# EasyEDA Pro project RemoteController.eprj

# Schematic Schematic1
Create Date: 2024-01-11; Page Name: P1; Project Name: 机甲杯手柄pcb; Schematic Name: Schematic1; Update Date: 2024-02-25; Company: 嘉立创EDA; Page Size: A4; Version: V1.0
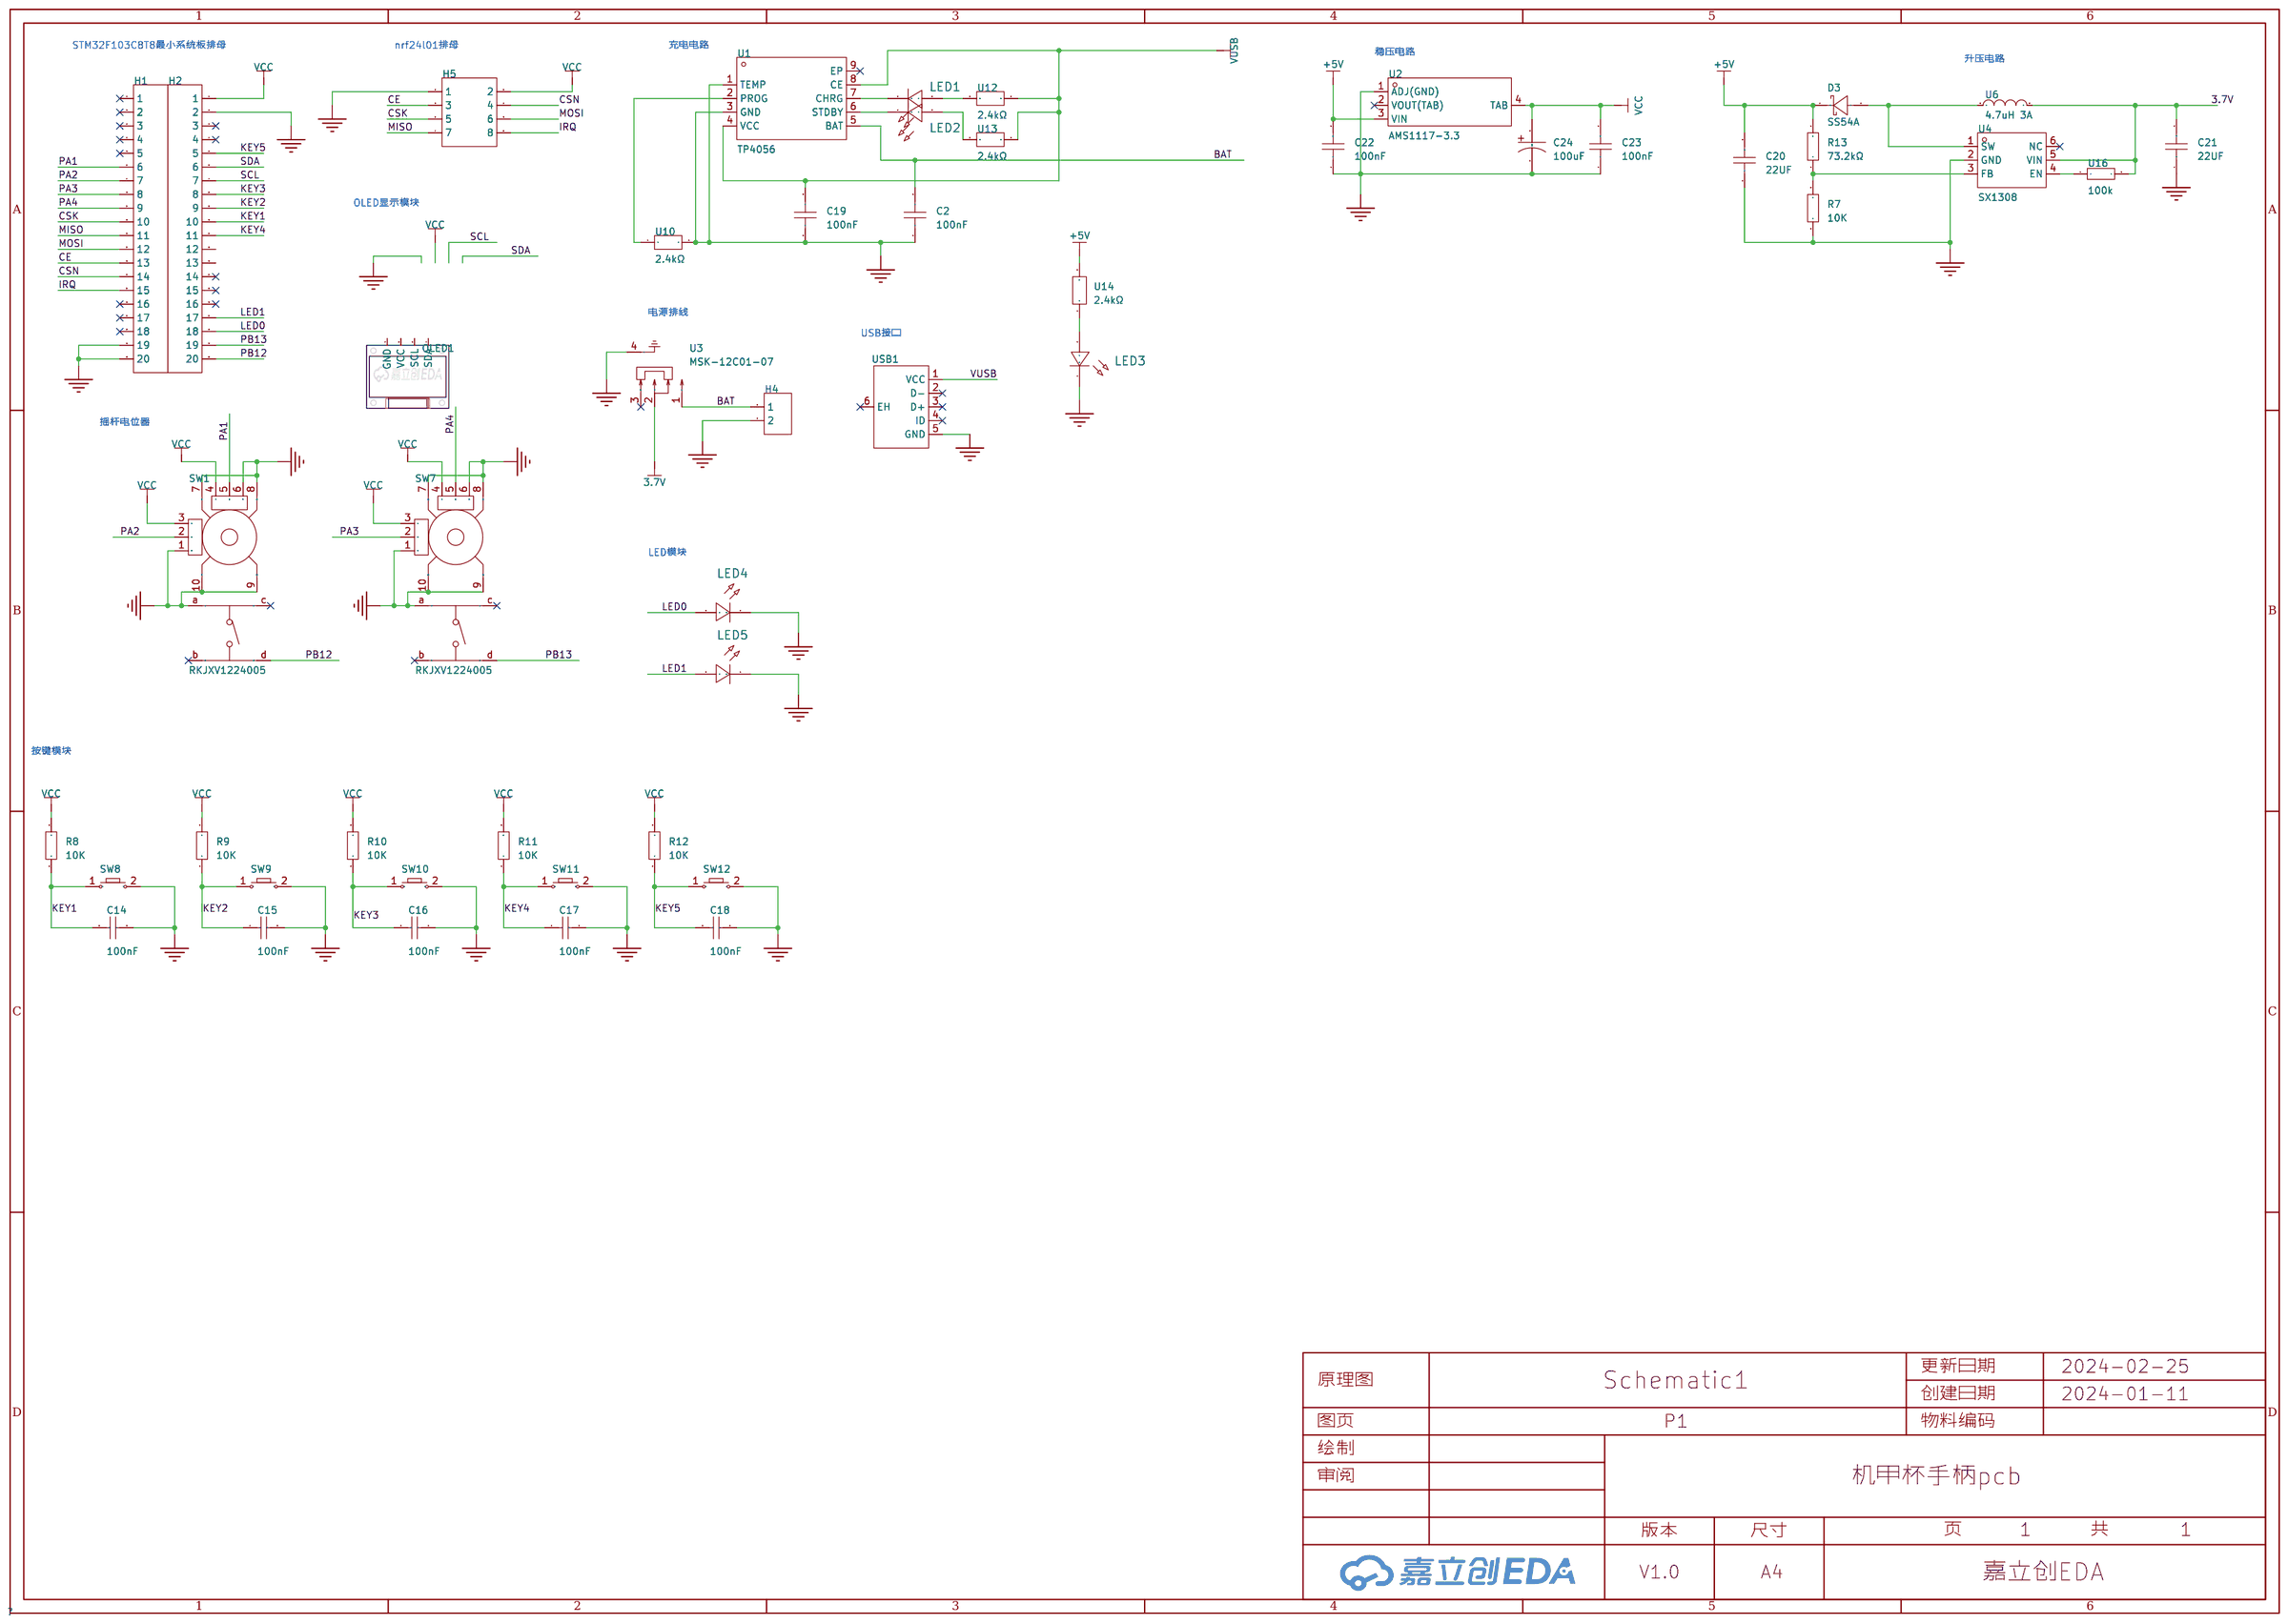
[diagram p0: schematic sheet]

## Parts
C2  100nF  [C0805]
C14  100nF  [C0805]
C15  100nF  [C0805]
C16  100nF  [C0805]
C17  100nF  [C0805]
C18  100nF  [C0805]
C19  100nF  [C0805]
C20  22UF  [C1206]
C21  22UF  [C1206]
C22  100nF  [C0603]
C23  100nF  [C0603]
C24  100uF  [CASE-D_7343]
D3  SS54A  [SMA_L4.2-W2.6-LS5.1-RD]
H1  -  [HDR-TH_20P-P2.54-V-F]
H2  -  [HDR-TH_20P-P2.54-V-F]
H4  -  [HDR-TH_2P-P2.54-V-F]
H5  -  [HDR-TH_8P-P2.54-V-F-R2-C4-S2.54-1]
LED1  -  [LED_0603]
LED2  -  [LED_0603]
LED3  -  [LED_0603]
LED4  -  [LED_0603]
LED5  -  [LED_0603]
OLED1  -  [0.96OLED_4P]
R7  10K  [R0603]
R8  10K  [R0603]
R9  10K  [R0603]
R10  10K  [R0603]
R11  10K  [R0603]
R12  10K  [R0603]
R13  73.2kΩ  [R0603]
SW1  RKJXV1224005  [SW-TH_RKJXV1224005]
SW7  RKJXV1224005  [SW-TH_RKJXV1224005]
SW8  -  [Key_SMD_3x4x2]
SW9  -  [Key_SMD_3x4x2]
SW10  -  [Key_SMD_3x4x2]
SW11  -  [Key_SMD_3x4x2]
SW12  -  [Key_SMD_3x4x2]
U1  TP4056  [ESOP-8_L4.9-W3.9-P1.27-LS6.0-BL-EP]
U2  AMS1117-3.3  [SOT-223-4_L6.5-W3.5-P2.30-LS7.0-BR]
U3  MSK-12C01-07  [SW-SMD_MSK12CO2-BDM]
U4  SX1308  [SOT-23-6_L2.9-W1.6-P0.95-LS2.8-BL]
U6  4.7uH 3A  [IND-SMD_L7.3-W7.3_GSDRH74P]
U10  2.4kΩ  [R0603]
U12  2.4kΩ  [R0603]
U13  2.4kΩ  [R0603]
U14  2.4kΩ  [R0603]
U16  100k  [R0603]
USB1  -  [USB_Micro]

## Library data of the parts
C2 C14-C19 = CL21B104KCFNNNE: 容值:100nF;精度:±10%;额定电压:100V;材质(温度系数):X7R;; LCSC Part Name: 100nF ±10% 100V; Supplier Part: C28233; Manufacturer: SAMSUNG(三星); Supplier Footprint: 0805; JLCPCB Part Class: 基础库; Datasheet: https://atta.szlcsc.com/upload/public/pdf/source/20160218/1457707763339.pdf; Supplier: LCSC; Tolerance: ±10%; Voltage Rated: 100V; Temperature Coefficient: X7R
C20 C21 = 22UF: Supplier Part: C9900008064; Supplier Footprint: 1206; JLCPCB Part Class: 扩展库; Supplier: LCSC
C22 C23 = CC0603KRX7R9BB104: 容值:100nF;精度:±10%;额定电压:50V;材质(温度系数):X7R;; LCSC Part Name: 100nF ±10% 50V; Supplier Part: C14663; Manufacturer: YAGEO(国巨); Supplier Footprint: 0603; JLCPCB Part Class: 基础库; Datasheet: https://atta.szlcsc.com/upload/public/pdf/source/20180910/C282072_33301C7F631E79921B82A8DAC6BCC5B3.pdf; Supplier: LCSC; Tolerance: ±10%; Voltage Rated: 50V; Temperature Coefficient: X7R
C24 = NOJD107M006RWJ: 容值:100uF;精度:±20%;额定电压:6.3V;等效串联电阻:400mΩ@100kHz;; LCSC Part Name: 100uF ±20% 6.3V; Supplier Part: C308911; Manufacturer: Kyocera AVX; Supplier Footprint: CASE-D-7343; JLCPCB Part Class: 扩展库; Datasheet: https://atta.szlcsc.com/upload/public/pdf/source/20181129/C313062_608915A7FC61F417DBFBE9E11EC9EEDE.pdf; Supplier: LCSC; Tolerance: ±20%; Rated Voltage: 6.3V; Equivalent Series Resistance(ESR): 400mΩ@100kHz; Operating Temperature: -55℃~+105℃
D3 = SS54A: 二极管配置:独立式;正向压降(Vf):550mV@5A;直流反向耐压(Vr):40V;平均整流电流(Io):5A;; LCSC Part Name: 电压:40V 电流:5A; Supplier Part: C842792; Manufacturer: FUXINSEMI(富芯森美); Supplier Footprint: SMA(DO-214AC); JLCPCB Part Class: 扩展库; Datasheet: https://atta.szlcsc.com/upload/public/pdf/source/20200930/C842792_5106C80DF0E850BA03D1CC0EA757AD9D.pdf; Supplier: LCSC; Diode Configuration: 独立式; Forward Voltage (Vf@If): 550mV@5A; Reverse Voltage (Vr): 40V; Average Rectified Current (Io): 5A; Reverse Leakage Current (Ir): 500nA
H1 H2 = HDR-F_2.54_1x20P: Supplier Part: C50984; Supplier Footprint: 插件
H4 = HDR-F_2.54_1x2P: Supplier Part: C49661; Supplier Footprint: 插件
H5 = HDR-F_2.54_2x4: Supplier Part: C92271; Supplier Footprint: 插件; JLCPCB Part Class: 扩展库
LED1-LED5 = LED_0603-R: Supplier Footprint: 0603
OLED1 = 0.96OLED模块_4P: Supplier Footprint: 插件
R7-R12 = Res_0603: Supplier Footprint: 0603
R13 = AC0603FR-0773K2L: 电阻类型:厚膜电阻;阻值:73.2kΩ;精度:±1%;功率:100mW;最大工作电压:75V;温度系数:±100ppm/℃;; LCSC Part Name: 厚膜电阻 73.2kΩ ±1% 100mW; Supplier Part: C228044; Manufacturer: YAGEO(国巨); Supplier Footprint: 0603; JLCPCB Part Class: 扩展库; Datasheet: https://atta.szlcsc.com/upload/public/pdf/source/20181031/C228044_B46D30D08D205BDF2C7D9FF4D943A2A8.pdf; Supplier: LCSC; Type: 厚膜电阻; Tolerance: ±1%; Power(Watts): 100mW; Overload Voltage (Max): 75V; Temperature Coefficient: ±100ppm/℃; Operating Temperature Range: -55℃~+155℃
SW1 SW7 = RKJXV1224005: 操纵杆复位 中央按动开关 适用于航模玩具遥控器电位器、3D摇杆PS4手柄游戏机、无人机摇杆电位器、工业控制器; Supplier Part: C146170; Manufacturer: ALPSALPINE(阿尔卑斯阿尔派); Supplier Footprint: 插件,13x13mm; JLCPCB Part Class: 扩展库; Datasheet: https://atta.szlcsc.com/upload/public/pdf/source/20180125/C146170_15168615510911301620.pdf; Supplier: LCSC
SW8-SW12 = Key_SMD_3x4x2: Supplier Footprint: SMD
U1 = TP4056: Supplier Part: C9900002169; Supplier Footprint: ESOP-8; JLCPCB Part Class: 扩展库; Supplier: LCSC
U2 = AMS1117-3.3_C347222: 输出类型:固定;最大输入电压:18V;输出电压:3.3V;输出电流:1A;电源纹波抑制比(PSRR):60dB@(120Hz);输出极性:正;; LCSC Part Name: 输入18V 输出3.3V 1A; Supplier Part: C347222; Manufacturer: UMW(友台半导体); Supplier Footprint: SOT-223; JLCPCB Part Class: 扩展库; Datasheet: https://atta.szlcsc.com/upload/public/pdf/source/20231109/155D79A26D9DB04352555A58D5969DC8.pdf; Supplier: LCSC; Output Type: 固定; Maximum Input Voltage: 18V; Output Voltage: 3.3V; Output Current: 1A; Power Supply Rejection Ratio (PSRR): 60dB@(120Hz); Dropout Voltage: 1.3V@(1A); Output Polarity: 正; Number of Outputs: 1
U3 = MSK-12C01-07: Supplier Part: C9900005167; Supplier Footprint: SMD; JLCPCB Part Class: 扩展库; Supplier: LCSC
U4 = SX1308: 功能类型:升压型;同步整流:否;输出通道数:1;拓扑结构:升压式;输入电压:2V~24V;输出电压:28V;输出电流(最大值):-;开关频率:1.2MHz;; LCSC Part Name: 升压型 Vin=2V~24V Vout=28V; Supplier Part: C78162; Manufacturer: SX(硕芯科技); Supplier Footprint: SOT-23-6; JLCPCB Part Class: 扩展库; Datasheet: https://atta.szlcsc.com/upload/public/pdf/source/20160920/1474356679185.pdf; Supplier: LCSC; Function: 升压型; Synchronous Rectification: 否; Number of Outputs: 1; Topology: 升压式; Input Voltage: 2V~24V; Output Voltage: 28V; Switching Frequency: 1.2MHz
U6 = 4.7uH 3A: Supplier Part: C9900003590; Supplier Footprint: 4.7uH2A; JLCPCB Part Class: 扩展库; Datasheet: https://atta.szlcsc.comnull; Supplier: LCSC
U10 U12-U14 = PTFR0603B2K40N9: 电阻类型:薄膜电阻;阻值:2.4kΩ;精度:±0.1%;功率:100mW;最大工作电压:100V;温度系数:±10ppm/℃;; LCSC Part Name: 薄膜电阻 2.4kΩ ±0.1% 100mW; Supplier Part: C2692752; Manufacturer: RESI(开步睿思）; Supplier Footprint: 0603; JLCPCB Part Class: 扩展库; Datasheet: https://atta.szlcsc.com/upload/public/pdf/source/20231020/37F75D505DFC5CA75CC16B0F0ECD8764.pdf; Supplier: LCSC; Type: 薄膜电阻; Tolerance: ±0.1%; Power(Watts): 100mW; Overload Voltage (Max): 100V; Temperature Coefficient: ±10ppm/℃; Operating Temperature Range: -55℃~+125℃
U16 = 100k: Supplier Part: C9900012835; JLCPCB Part Class: 扩展库; Supplier: LCSC
USB1 = USB_Micro-B: Supplier Footprint: SMD

## Nets
3.7V: C21.2 U3.2 U4.5(VIN) U6.2 U16.2
+5V: C20.2 C22.2 D3.1(C) R13.2 U2.3(VIN) U14.2
GND: C2.1 C14.2 C15.2 C16.2 C17.2 C18.2 C19.1 C20.1 C21.1 C22.1 C23.1 C24.2 H1.19 H1.20 H2.2 H4.2 H5.1 LED3.1(C) LED4.1(C) LED5.1(C) R7.1 SW1.1(B) SW1.6(B) SW1.7(GND) SW1.8(GND) SW1.9(GND) SW1.10(GND) SW1.a SW7.1(B) SW7.6(B) SW7.7(GND) SW7.8(GND) SW7.9(GND) SW7.10(GND) SW7.a SW8.2 SW9.2 SW10.2 SW11.2 SW12.2 U1.1(TEMP) U1.3(GND) U2.1(ADJ(GND)) U3.4 U4.2(GND) U10.2 USB1.5(GND)
VCC: C23.2 C24.1 H2.1 H5.2 R8.2 R9.2 R10.2 R11.2 R12.2 SW1.3(A) SW1.4(A) SW7.3(A) SW7.4(A) U2.4(TAB)
BAT: C2.2 H4.1 U1.5(BAT) U3.1
CE: H1.13 H5.3
CSK: H1.10 H5.5
CSN: H1.14 H5.4
IRQ: H1.15 H5.8
KEY1: C14.1 H2.10 R8.1 SW8.1
KEY2: C15.1 H2.9 R9.1 SW9.1
KEY3: C16.1 H2.8 R10.1 SW10.1
KEY4: C17.1 H2.11 R11.1 SW11.1
KEY5: C18.1 H2.5 R12.1 SW12.1
LED0: H2.18 LED4.2(A)
LED1: H2.17 LED5.2(A)
MISO: H1.11 H5.7
MOSI: H1.12 H5.6
PA1: H1.6 SW1.5(DTA)
PA2: H1.7 SW1.2(DTA)
PA3: H1.8 SW7.2(DTA)
PA4: H1.9 SW7.5(DTA)
PB12: H2.20 SW1.d
PB13: H2.19 SW7.d
SCL: H2.7
SDA: H2.6
VUSB: C19.2 U1.4(VCC) U1.8(CE) U12.2 U13.2 USB1.1(VCC)
$1N9186: U1.2(PROG) U10.1
$1N9797: LED1.1(C) U1.7(CHRG)
$1N9800: LED2.1(C) U1.6(STDBY)
$1N9803: LED1.2(A) U12.1
$1N9806: LED2.2(A) U13.1
$1N10862: LED3.2(A) U14.1
$1N14342: U4.4(EN) U16.1
$1N14522: R7.2 R13.1 U4.3(FB)
$1N32004: D3.2(A) U4.1(SW) U6.1

Not connected (* = marked no-connect by the designer): H1 1* 2* 3* 4* 5* 16* 17* 18*; H2 3* 4* 12 13 14* 15* 16*; OLED1 1(GND) 2(VCC) 3(SCL) 4(SDA); SW1 b* c*; SW7 b* c*; U1 9(EP)*; U2 2(VOUT(TAB))*; U3 3*; U4 6(NC)*; USB1 2(D-)* 3(D+)* 4(ID)* 6(EH)*

## Notes on the sheet
- STM32F103C8T8最小系统板排母
- nrf24l01排母
- 充电电路
- 稳压电路
- 升压电路
- OLED显示模块
- 电源排线
- USB接口
- 摇杆电位器
- LED模块
- 按键模块

# Board PCB1
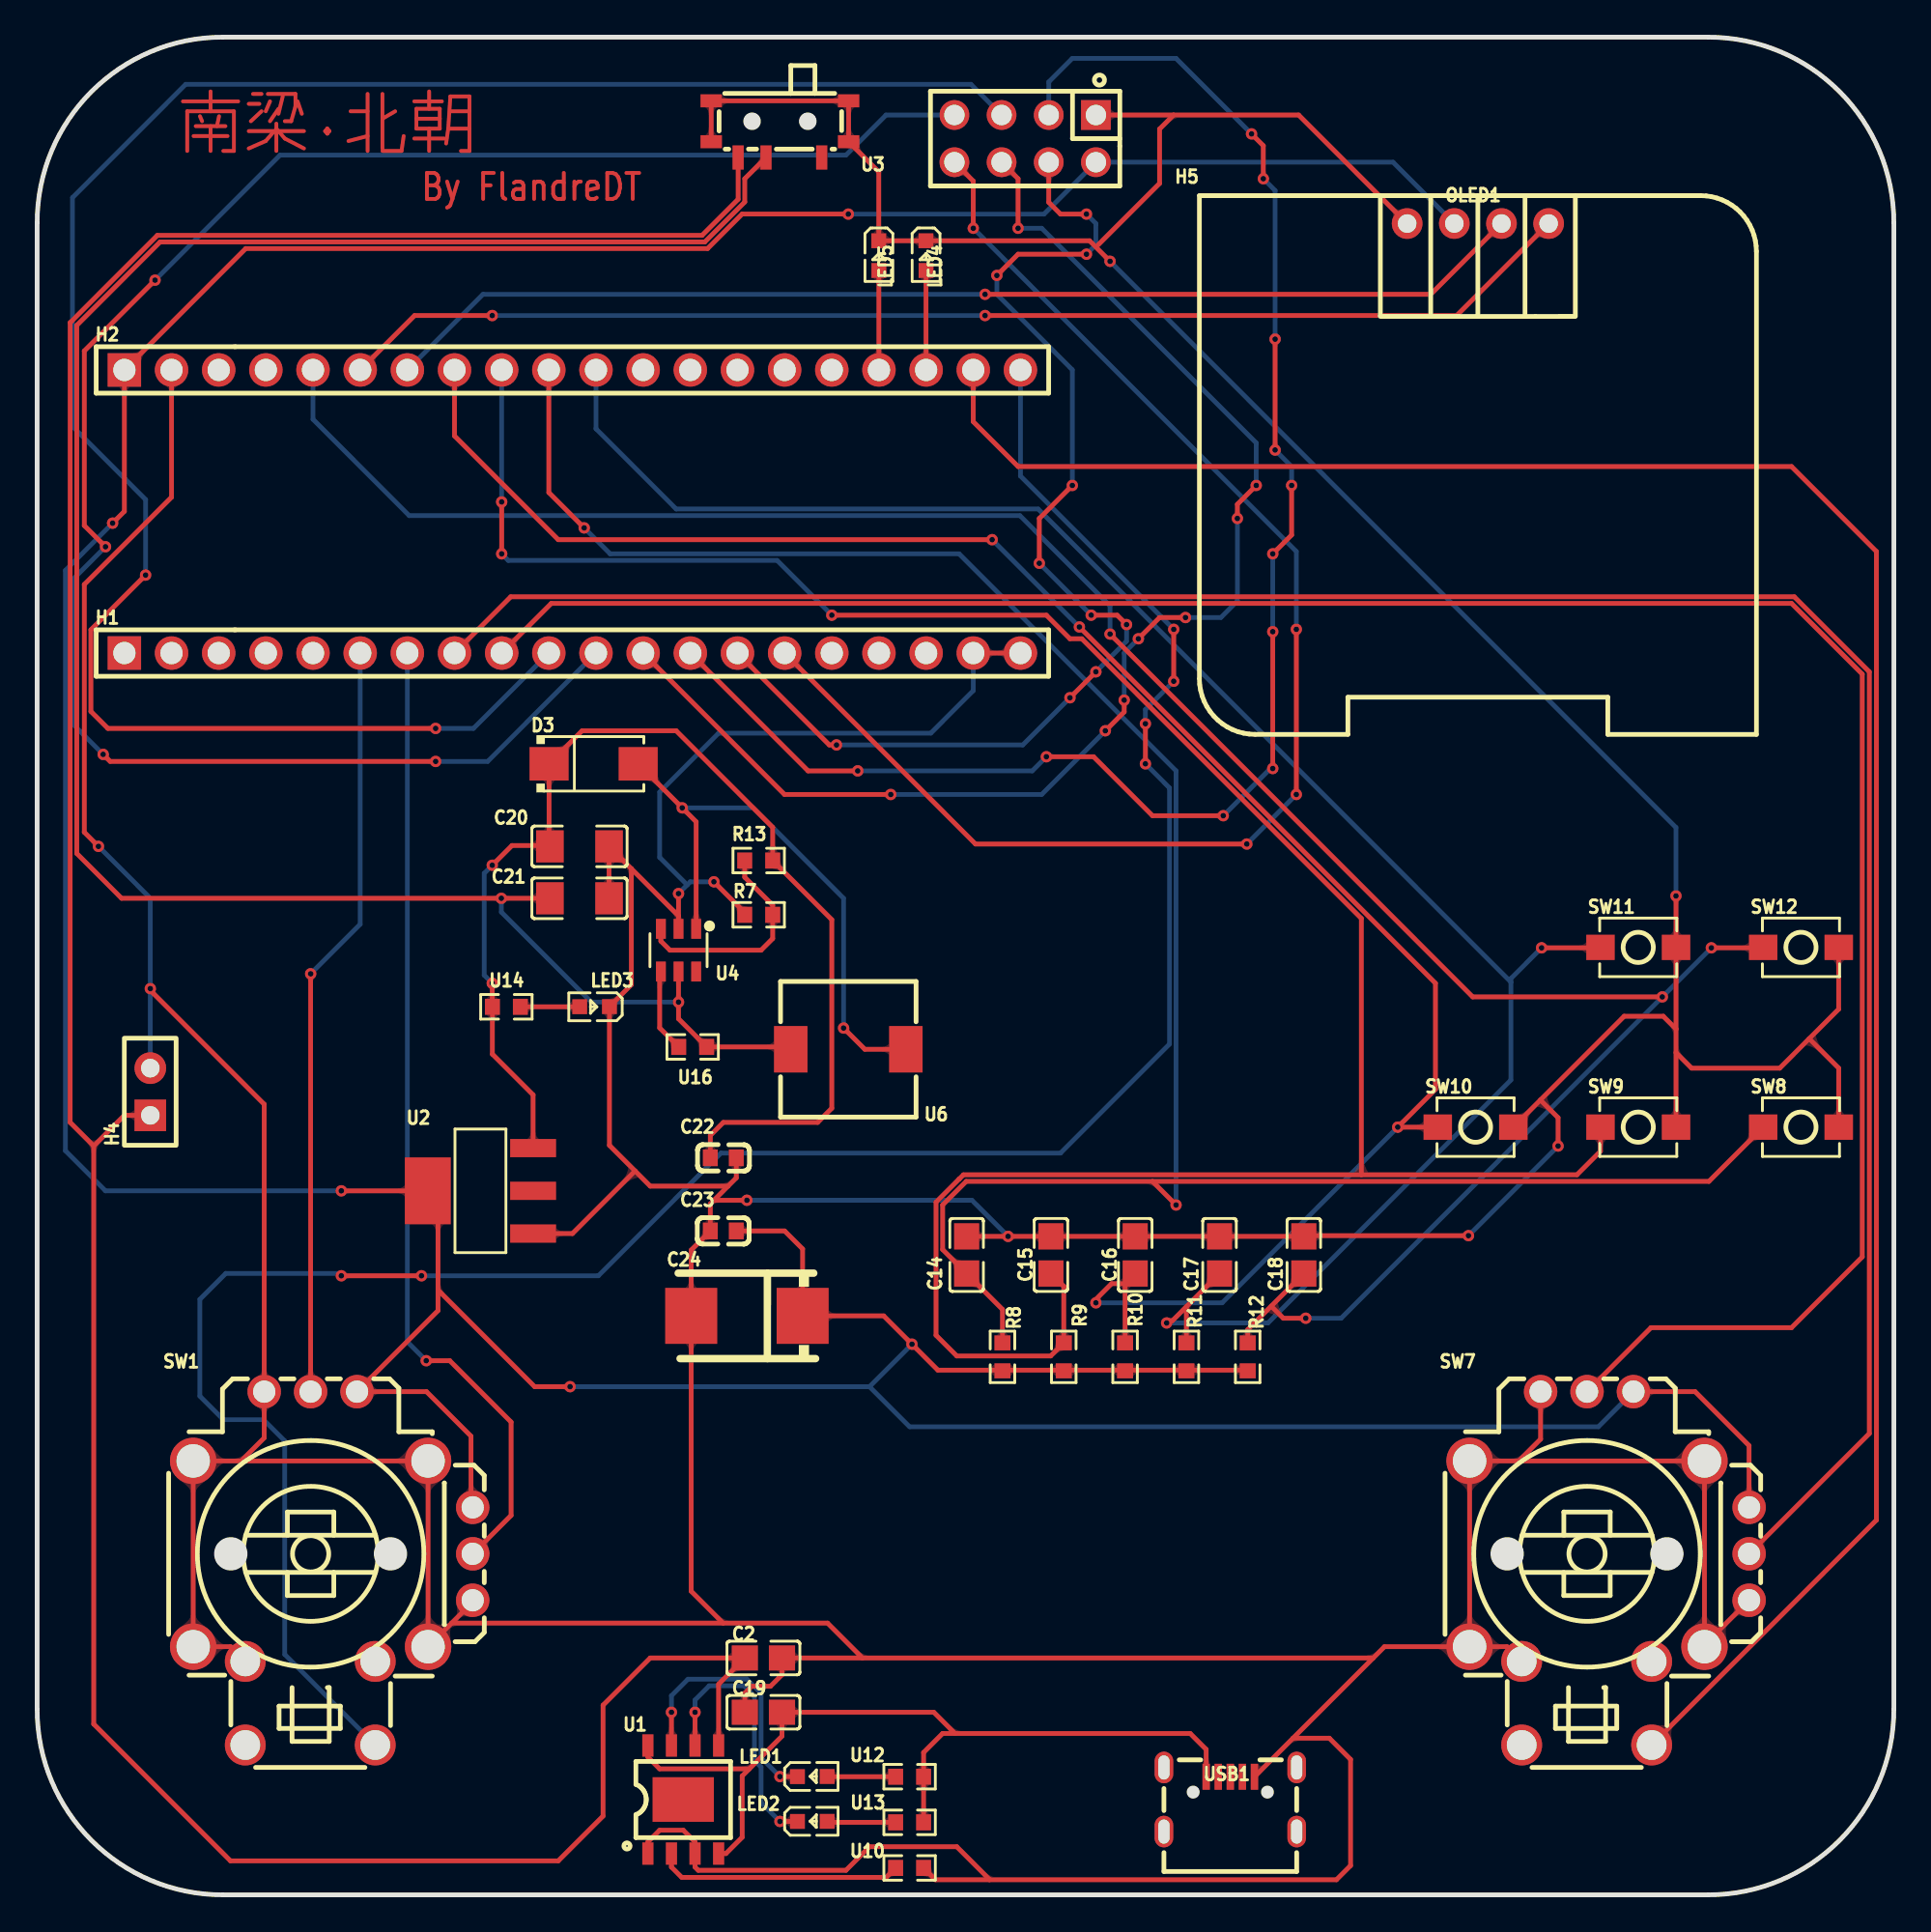
[diagram p1: board, top side]
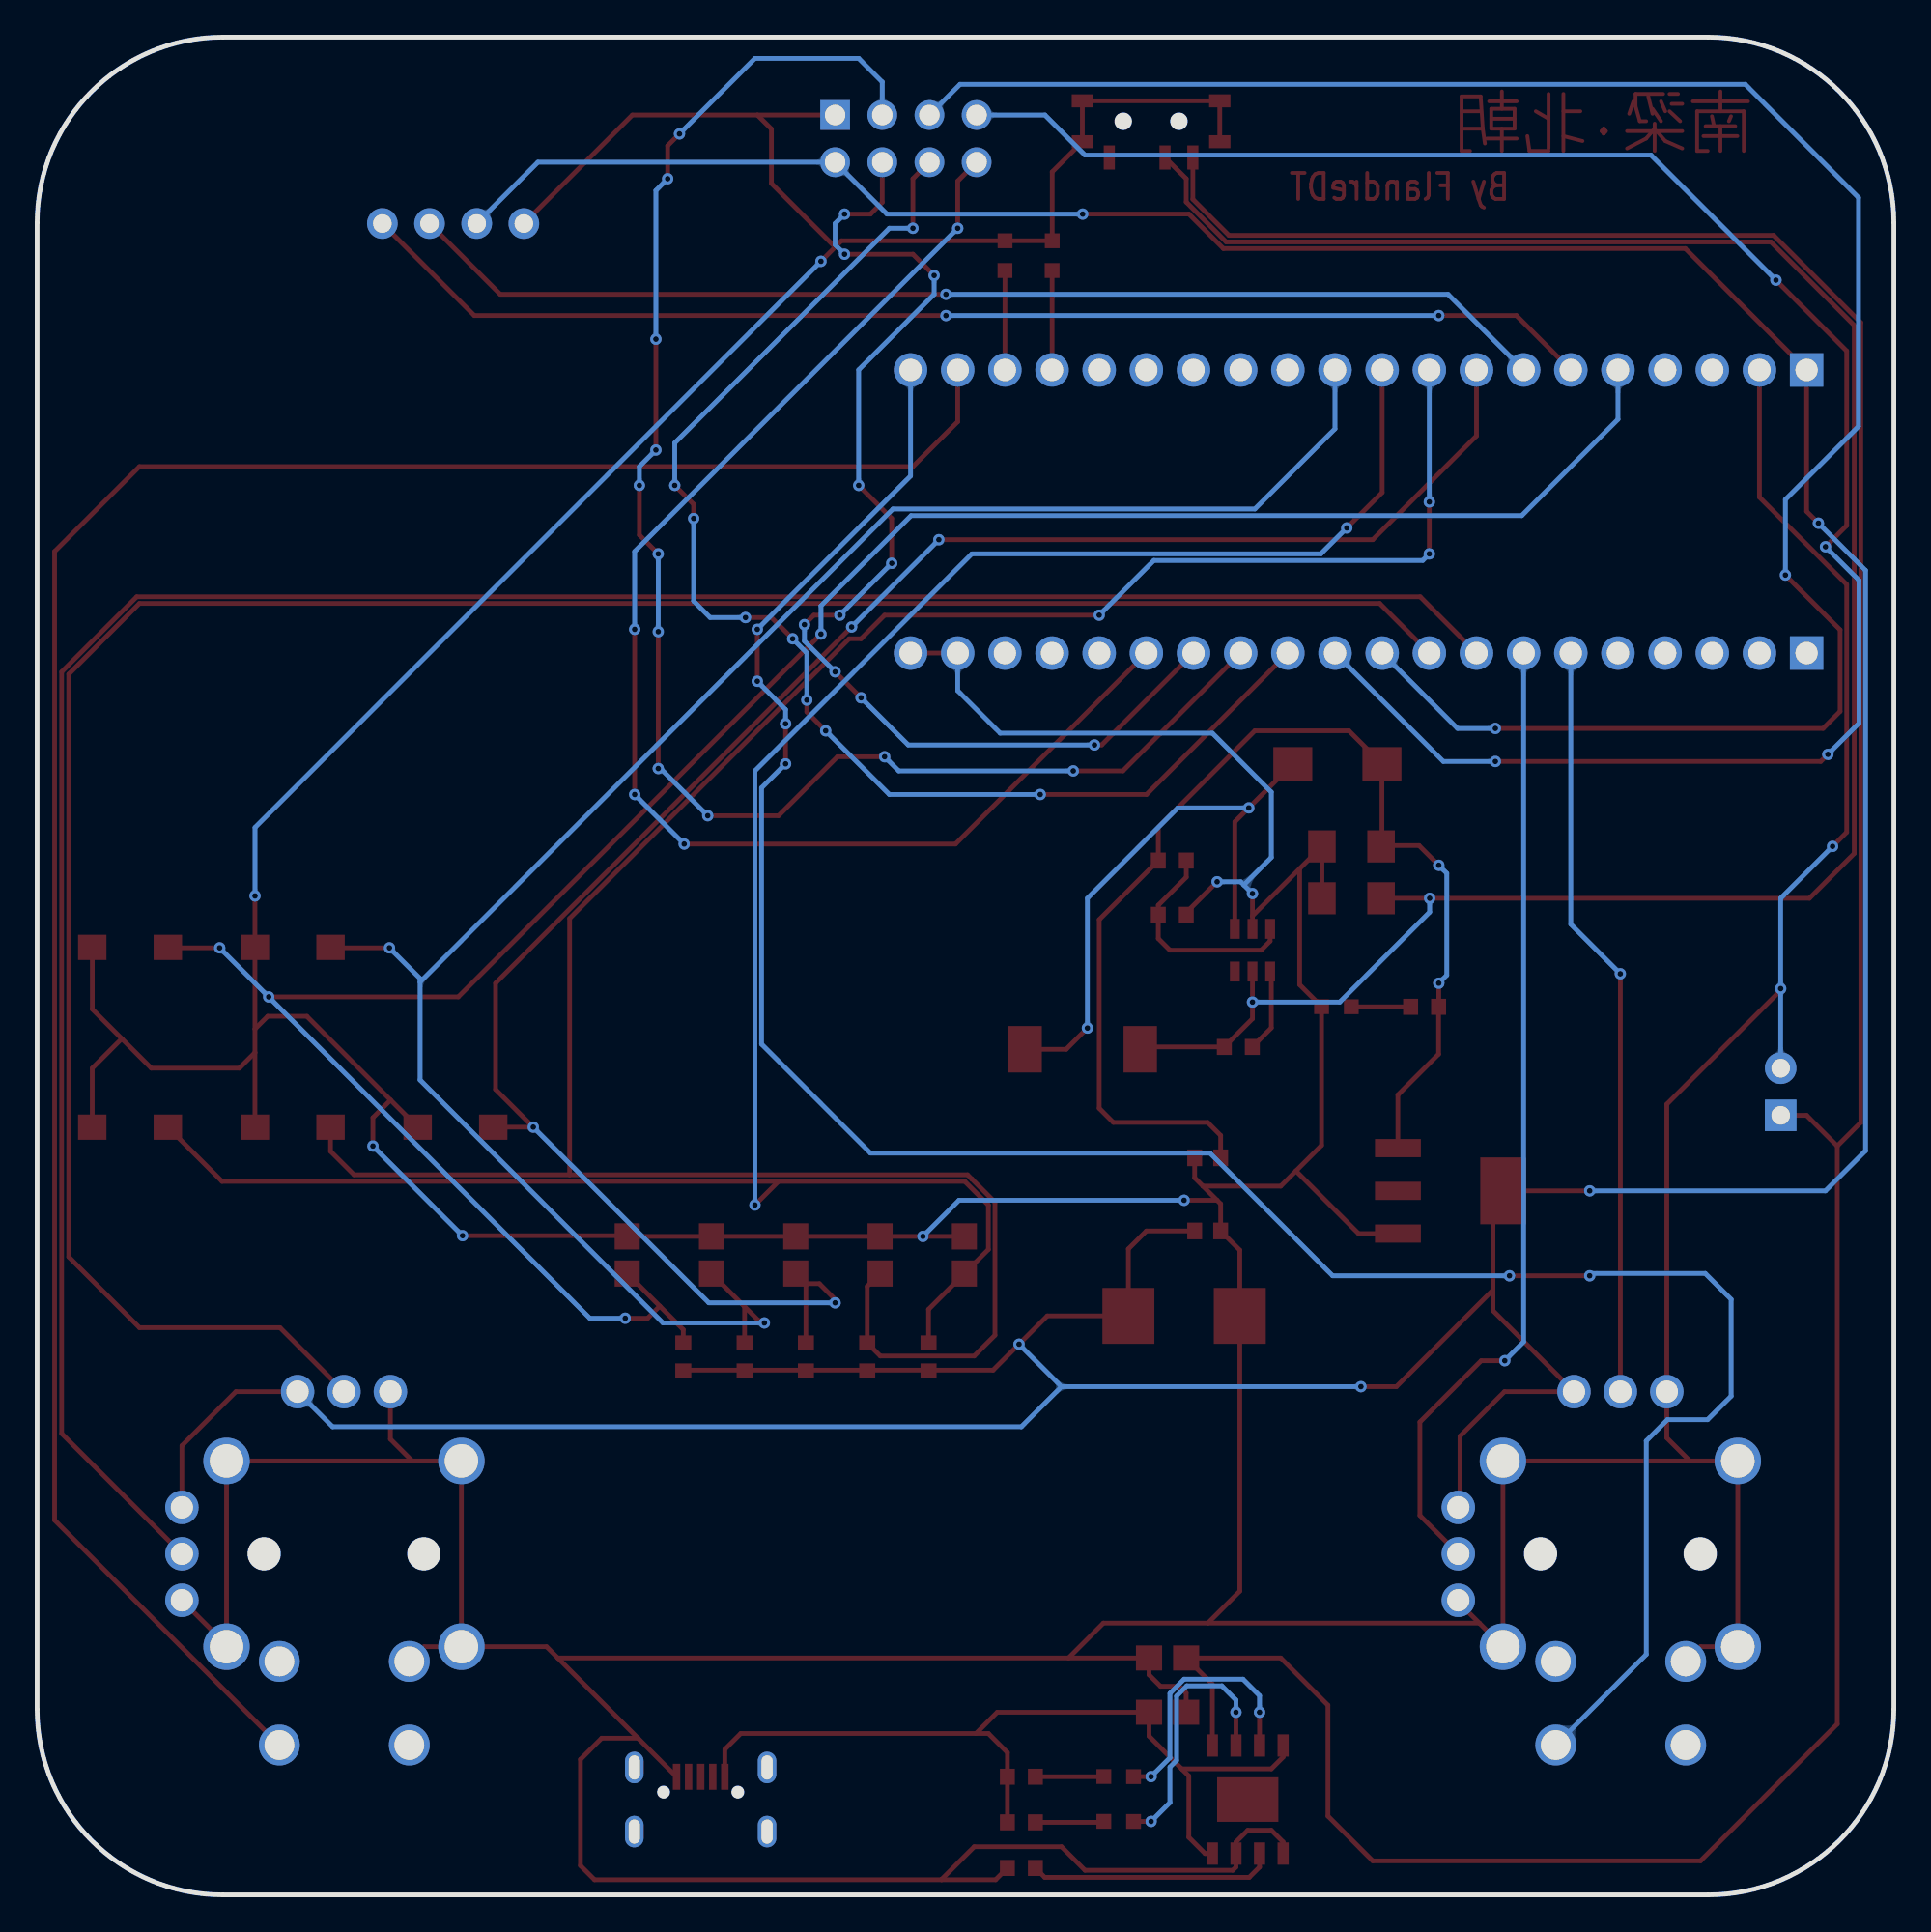
[diagram p2: board, bottom side, seen from below]

Outline 100 x 100 mm; copper layers: Top Layer, Inner1, 内层2, Bottom Layer. Coordinates in mm from the lower left corner of the outline.
Outline path: 0,90 arc(2.93,97.07) 10,100 90,100 arc(97.07,97.07) 100,90 100,10 arc(97.07,2.93) 90,0 10,0 arc(2.93,2.93) 0,10 0,90
Stack: Top Layer 0.035mm 外层铜厚1oz / Dielectric1 0.2104mm 7628 RC49% 8.6mil / Inner1 0.0152mm 内层铜厚 / Dielectric2 1.065mm 1.1mm H/HOZ 含铜 / 内层2 0.0152mm 内层铜厚 / Dielectric3 0.2104mm 7628 RC49% 8.6mil / Bottom Layer 0.035mm 外层铜厚1oz

## Design rules (mm)
template: 自定义配置
spacing copperThickness1oz (default): track to track 0.102, other pairs 0.152 to 0.3
spacing copperThickness2oz: track to track 0.203, other pairs 0.152 to 0.3
track width copperThickness1oz (default): min 0.127, default 0.254, max 2.54
track width copperThickness2oz: min 0.203, default 0.254, max 2.54
differential pair differentialPair (default): width min 0.127, default 0.254, max 2.54; gap min 0.152, default 0.152
via viaSize (default): diameter min 0.5, default 0.61, max 10; hole min 0.3, default 0.305, max 6.3

## Placement (name value [footprint] x y rotation side)
C2  100nF  [C0805]  39.12 12.75 180 top
C14  100nF  [C0805]  50.06 34.45 90 top
C15  100nF  [C0805]  54.6 34.45 90 top
C16  100nF  [C0805]  59.14 34.45 90 top
C17  100nF  [C0805]  63.68 34.45 90 top
C18  100nF  [C0805]  68.22 34.45 90 top
C19  100nF  [C0805]  39.12 9.83 0 top
C20  22UF  [C1206]  29.21 56.44 180 top
C21  22UF  [C1206]  29.21 53.65 180 top
C22  100nF  [C0603]  36.96 39.68 180 top
C23  100nF  [C0603]  36.96 35.74 0 top
C24  100uF  [CASE-D_7343]  38.23 31.17 0 top
D3  SS54A  [SMA_L4.2-W2.6-LS5.1-RD]  29.97 60.88 0 top
H1  -  [HDR-TH_20P-P2.54-V-F]  28.83 66.85 0 top
H2  -  [HDR-TH_20P-P2.54-V-F]  28.83 82.09 0 top
H4  -  [HDR-TH_2P-P2.54-V-F]  6.1 43.23 90 top
H5  -  [HDR-TH_8P-P2.54-V-F-R2-C4-S2.54-1]  53.21 94.54 180 top
LED1  -  [LED_0603]  41.8 6.38 0 top
LED2  -  [LED_0603]  41.8 3.96 0 top
LED3  -  [LED_0603]  29.97 47.8 180 top
LED4  -  [LED_0603]  47.88 88.19 270 top
LED5  -  [LED_0603]  45.34 88.19 270 top
OLED1  -  [0.96OLED_4P]  77.6 89.97 0 top
R7  10K  [R0603]  38.86 52.76 0 top
R8  10K  [R0603]  51.99 28.96 270 top
R9  10K  [R0603]  55.29 28.96 270 top
R10  10K  [R0603]  58.59 28.96 270 top
R11  10K  [R0603]  61.9 28.96 270 top
R12  10K  [R0603]  65.2 28.96 270 top
R13  73.2kΩ  [R0603]  38.86 55.68 0 top
SW1  RKJXV1224005  [SW-TH_RKJXV1224005]  15.93 17.58 0 top
SW7  RKJXV1224005  [SW-TH_RKJXV1224005]  84.68 17.58 0 top
SW8  -  [Key_SMD_3x4x2]  95 41.33 0 top
SW9  -  [Key_SMD_3x4x2]  86.23 41.33 0 top
SW10  -  [Key_SMD_3x4x2]  77.47 41.33 0 top
SW11  -  [Key_SMD_3x4x2]  86.23 51 0 top
SW12  -  [Key_SMD_3x4x2]  95 51 0 top
U1  TP4056  [ESOP-8_L4.9-W3.9-P1.27-LS6.0-BL-EP]  34.8 5.13 0 top
U2  AMS1117-3.3  [SOT-223-4_L6.5-W3.5-P2.30-LS7.0-BR]  23.88 37.9 0 top
U3  MSK-12C01-07  [SW-SMD_MSK12CO2-BDM]  40 95.05 180 top
U4  SX1308  [SOT-23-6_L2.9-W1.6-P0.95-LS2.8-BL]  34.54 50.85 180 top
U6  4.7uH 3A  [IND-SMD_L7.3-W7.3_GSDRH74P]  43.69 45.52 180 top
U10  2.4kΩ  [R0603]  46.99 1.45 0 top
U12  2.4kΩ  [R0603]  46.99 6.36 0 top
U13  2.4kΩ  [R0603]  46.99 3.9 0 top
U14  2.4kΩ  [R0603]  25.27 47.8 180 top
U16  100k  [R0603]  35.31 45.64 0 top
USB1  -  [USB_Micro]  64.26 5.13 0 top

## Footprints (pads in the part's own frame, mm; a bottom-side part is the same pattern mirrored in y, then rotated)
0.96OLED_4P
  round 1.65 hole 1: 1(-3.81,-0.002) 2(-1.27,0.002) 3(1.27,0.002) 4(3.81,0.002)
C0603
  rect 0.8x0.9 smd: 1(-0.7,0) 2(0.7,0)
C0805
  rect 1.41x1.35 smd: 1(-1,0) 2(1,0)
C1206
  rect 1.485x1.728 smd: 1(-1.593,0) 2(1.593,0)
CASE-D_7343
  rect 2.799x3.01 smd: 1(3,0) 2(-3,0)
ESOP-8_L4.9-W3.9-P1.27-LS6.0-BL-EP
  rect 0.6x1.2 smd: 1(-1.905,-2.909) 2(-0.635,-2.909) 3(0.635,-2.909) 4(1.905,-2.909) 5(1.905,2.909) 6(0.635,2.909) 7(-0.635,2.909) 8(-1.905,2.909)
  rect 3.3x2.4 smd: 9(0,0)
HDR-TH_2P-P2.54-V-F
  rect 1.7x1.7 hole 1: 1(-1.27,0)
  round 1.7 hole 1: 2(1.27,0)
HDR-TH_8P-P2.54-V-F-R2-C4-S2.54-1
  rect 1.6x1.6 hole 1.1: 1(-3.81,-1.27)
  round 1.6 hole 1.1: 2(-3.81,1.27) 3(-1.27,-1.27) 4(-1.27,1.27) 5(1.27,-1.27) 6(1.27,1.27) 7(3.81,-1.27) 8(3.81,1.27)
HDR-TH_20P-P2.54-V-F
  rect 1.8x1.8 hole 1.2: 1(-24.13,0)
  round 1.8 hole 1.2: 2(-21.59,0) 3(-19.05,0) 4(-16.51,0) 5(-13.97,0) 6(-11.43,0) 7(-8.89,0) 8(-6.35,0) 9(-3.81,0) 10(-1.27,0) 11(1.27,0) 12(3.81,0) 13(6.35,0) 14(8.89,0) 15(11.43,0) 16(13.97,0) 17(16.51,0) 18(19.05,0) 19(21.59,0) 20(24.13,0)
IND-SMD_L7.3-W7.3_GSDRH74P
  rect 1.8x2.5 smd: 1(-3.1,0) 2(3.1,0)
Key_SMD_3x4x2
  rect 1.53x1.36 smd: 1(-2.035,0) 2(2.035,0)
LED_0603
  rect 0.8x0.8 smd: 1(-0.851,-0.01) 2(0.75,-0.005)
R0603
  rect 0.806x0.864 smd: 1(-0.753,0) 2(0.753,0)
SMA_L4.2-W2.6-LS5.1-RD
  rect 2.1x1.8 smd: 1(-2.4,0) 2(2.4,0)
SOT-23-6_L2.9-W1.6-P0.95-LS2.8-BL
  rect 0.532x1.072 smd: 1(-0.95,-1.149) 2(0,-1.149) 3(0.95,-1.149) 4(0.95,1.149) 5(0,1.149) 6(-0.95,1.149)
SOT-223-4_L6.5-W3.5-P2.30-LS7.0-BR
  rect 2.47x0.98 smd: 1(2.835,-2.3) 2(2.835,0) 3(2.835,2.3)
  rect 2.47x3.6 smd: 4(-2.835,0)
SW-SMD_MSK12CO2-BDM
  rect 0.6x1.3 smd: 1(2.25,1.525) 2(0.75,1.525) 3(-2.25,1.525)
  rect 1.15x0.7 smd: 4(-3.7,0.675) 4(-3.7,-1.525) 4(3.7,0.675) 4(3.7,-1.525)
SW-TH_RKJXV1224005
  round 1.8 hole 1.2: 1(7.527,-1.719) 2(7.527,0.781) 3(7.527,3.281) 4(1.298,9.511) 5(-1.202,9.511) 6(-3.703,9.511)
  round 2.5 hole 1.8: 7(-7.527,5.781) 8(-7.527,-4.219) 9(5.122,-4.219) 10(5.122,5.781)
  round 2.2 hole 1.6: a(-4.721,-5.011) b(-4.721,-9.511) c(2.279,-5.011) d(2.279,-9.511)
USB_Micro
  rect 0.4x1.4 smd: 1(-1.3,1.225) 2(-0.65,1.225) 3(0,1.225) 4(0.65,1.225) 5(1.3,1.225)
  oval 1x1.7 hole 0.6x1.3: 6(-3.575,1.725) 6(-3.575,-1.725) 6(3.575,1.725) 6(3.575,-1.725)

## Nets
As in the schematic, except:
GND: C2.1 C14.2 C15.2 C16.2 C17.2 C18.2 C19.1 C20.1 C21.1 C22.1 C23.1 C24.2 H1.19 H1.20 H2.2 H4.2 H5.1 LED3.1 LED4.1 LED5.1 OLED1.1 R7.1 SW1.1 SW1.6 SW1.7 SW1.8 SW1.9 SW1.10 SW1.a SW7.1 SW7.6 SW7.7 SW7.8 SW7.9 SW7.10 SW7.a SW8.2 SW9.2 SW10.2 SW11.2 SW12.2 U1.1 U1.3 U2.1 U3.4 U4.2 U10.2 USB1.5
VCC: C23.2 C24.1 H2.1 H5.2 OLED1.2 R8.2 R9.2 R10.2 R11.2 R12.2 SW1.3 SW1.4 SW7.3 SW7.4 U2.4
SCL: H2.7 OLED1.3
SDA: H2.6 OLED1.4

Pads without a net: H1 1 2 3 4 5 16 17 18; H2 3 4 12 13 14 15 16; SW1 b c; SW7 b c; U1 9; U2 2; U3 3; U4 6; USB1 2 3 4 6

## Via types
v1: diameter 0.61, hole 0.305, Top Layer to Bottom Layer, 90 vias

## Routing (per net, layer and track width the routed paths; a pad name or vN(x,y) marks a point on that pad's centre or on a via; arc(x,y) is an arc through that point)
3.7V: length 118.1
  Top Layer w0.254: U3.2 38.11,92.38 38.11,91.13 35.96,88.98 6.62,88.98 2.13,84.49 2.13,56.06 4.55,53.65 v1(25,53.65) C21.2 ; U4.5 v1(34.54,48.06) 34.54,47.16 U16.2 40.46,45.64 U6.2
  Bottom Layer w0.254: v1(34.54,48.06) 29.84,48.06 25,52.9 v1(25,53.65)
+5V: length 64.2
  Top Layer w0.254: 26.71,40.2 26.71,43.06 24.52,45.25 U14.2 24.51,47.81 v1(24.51,49.07) ; 27.57,56.48 D3.1 29.35,62.66 34.42,62.66 39.62,57.46 R13.2 42.8,52.49 42.8,42.34 42.04,41.58 36.96,41.58 36.26,40.88 C22.2 ; 27.57,56.48 25.57,56.48 v1(24.51,55.42) ; 27.57,56.48 C20.2
  Bottom Layer w0.254: v1(24.51,49.07) 24.08,49.51 24.08,54.99 v1(24.51,55.42)
GND: length 582.9
  Top Layer w0.254: 32.2,38.97 28.83,35.6 26.71,35.6 ; 32.2,38.97 30.82,40.35 LED3.1 32,48.99 32,55.24 ; 32.2,38.97 33.02,38.15 37.21,38.15 ; v1(88.27,53.77) 88.27,53.77 SW11.2 88.27,46.61 ; 32,55.24 34.54,52.7 ; 32,55.24 C20.1 C21.1 ; 34.54,52.7 U4.2 ; 34.54,52.7 v1(34.54,53.9) ; 95.44,46.09 97.03,47.68 97.03,51 SW12.2 ; 95.44,46.09 93.85,44.5 89.11,44.5 88.27,45.34 ; 95.44,46.09 97.03,44.5 SW8.2 ; 36.45,37.39 36.26,37.2 C23.1 35.23,34.71 C24.2 35.23,16.35 36.94,14.63 ; 36.45,37.39 v1(38.23,37.39) ; 36.45,37.39 37.21,38.15 ; 10.99,23.36 SW1.7 SW1.8 10.42,13.36 SW1.a ; 10.99,23.36 SW1.10 SW1.9 22.32,14.63 ; 10.99,23.36 12.23,24.6 SW1.6 12.23,42.56 6.1,48.69 ; 61.21,95.81 67.94,95.81 OLED1.1 ; 61.21,95.81 H5.1 ; 61.21,95.81 60.45,95.06 60.45,92.13 57.15,88.82 ; v1(81.92,40.31) 81.92,41.83 80.96,42.79 ; C19.1 38.12,10.86 38.48,11.23 39.5,11.23 40.12,11.85 C2.1 44.45,12.75 ; C14.2 v1(52.29,35.45) C15.2 C16.2 C17.2 C18.2 68.26,35.48 v1(77.09,35.48) ; 36.94,14.63 42.57,14.63 44.45,12.75 ; 36.94,14.63 22.32,14.63 ; 44.45,12.75 71.96,12.75 ; 71.96,12.75 72.56,13.36 77.15,13.36 ; 71.96,12.75 67.64,8.43 ; 51.29,0.81 48.38,0.81 U10.2 ; 51.29,0.81 69.98,0.81 70.74,1.58 70.74,7.29 69.6,8.43 67.64,8.43 ; 51.29,0.81 51.29,0.83 49.53,2.59 44.83,2.59 43.56,1.32 35.61,1.32 35.43,1.5 U1.3 35.43,2.84 34.8,3.48 33.53,3.48 32.89,2.84 U1.1 ; v1(57.78,87.94) 56.68,89.04 LED5.1 45.33,92.75 U3.4 U3.4 U3.4 U3.4 ; SW7.6 80.97,24.53 79.8,23.36 ; 67.64,8.43 USB1.5 ; 89.8,13.45 SW7.9 ; 89.8,13.45 SW7.10 79.8,23.36 ; 89.8,13.45 SW7.1 ; 88.27,45.34 SW9.2 ; 88.27,45.34 88.27,46.61 ; 77.15,13.36 77.15,23.36 79.8,23.36 ; 77.15,13.36 79.16,13.36 SW7.a ; H1.19 H1.20 ; SW1.1 23.46,15.76 22.32,14.63 ; v1(36.45,54.53) 38.11,52.87 R7.1 ; 80.96,42.79 85.47,47.3 87.58,47.3 88.27,46.61 ; 80.96,42.79 SW10.2 ; 37.21,38.15 37.66,38.6 C22.1 ; H2.2 7.24,75.24 2.54,70.54 2.54,57.2 v1(3.3,56.44)
  Bottom Layer w0.254: v1(34.54,53.9) 35.01,54.36 ; 35.01,54.36 35.18,54.53 v1(36.45,54.53) ; 35.01,54.36 33.53,55.85 33.53,59.36 36.7,62.54 48.13,62.54 50.42,64.82 H1.19 ; v1(81.92,40.31) v1(77.09,35.48) ; H4.2 v1(6.1,48.78) 6.1,53.65 v1(3.3,56.44) ; v1(88.27,53.77) 88.27,57.46 v1(57.78,87.94) ; v1(52.29,35.45) 50.35,37.39 v1(38.23,37.39)
VCC: length 280.2
  Top Layer w0.254: C23.2 40.26,35.74 41.23,34.77 C24.1 45.59,31.17 v1(47.12,29.64) 48.51,28.25 65.16,28.25 R12.2 ; 21.59,32.56 21.59,31.45 SW1.4 20.97,27.09 23.37,24.69 23.37,20.95 SW1.3 ; 21.59,32.56 26.79,27.36 v1(28.7,27.36) ; 21.59,32.56 21.59,37.35 U2.4 v1(16.38,37.9) ; v1(43.69,90.48) 43.68,90.48 37.97,90.48 36.11,88.62 11.23,88.62 H2.1 4.7,74.47 v1(4.06,73.84) ; SW7.3 92.2,20.86 92.2,24.18 89.3,27.09 SW7.4
  Bottom Layer w0.254: v1(4.06,73.84) 1.52,71.3 1.52,40.06 3.68,37.9 v1(16.38,37.9) ; SW7.4 84.08,25.2 46.99,25.2 44.83,27.36 ; 44.83,27.36 v1(28.7,27.36) ; 44.83,27.36 v1(47.12,29.64) ; v1(43.69,90.48) 54.23,90.48 H5.2 73.03,93.27 OLED1.2
BAT: length 172.1
  Top Layer w0.254: 3.05,40.31 1.78,41.58 1.78,84.63 6.48,89.33 35.81,89.33 37.75,91.27 U3.1 ; 3.05,40.31 3.05,9.2 10.41,1.83 28.07,1.83 30.48,4.24 30.48,10.21 33.02,12.75 C2.2 36.7,11.34 U1.5 ; 3.05,40.31 4.7,41.96 H4.1
CE: length 87.1
  Top Layer w0.254: v1(44.2,60.5) 41.52,60.5 H1.13 ; v1(66.55,72.19) 67.56,73.2 v1(67.56,75.87) ; v1(54.36,61.27) 56.9,61.27 60.07,58.09 v1(63.88,58.09) ; v1(65.4,94.79) 66.04,94.16 v1(66.04,92.38) ; v1(66.67,77.78) v1(66.67,83.74) ; v1(66.55,60.63) v1(66.55,68)
  Bottom Layer w0.254: v1(66.55,68) v1(66.55,72.19) ; v1(44.2,60.5) 53.59,60.5 v1(54.36,61.27) ; H5.3 54.48,97.59 55.75,98.86 61.34,98.86 v1(65.4,94.79) ; v1(67.56,75.87) 67.56,76.89 v1(66.67,77.78) ; v1(66.67,83.74) 66.67,91.75 v1(66.04,92.38) ; v1(63.88,58.09) 66.42,60.63 v1(66.55,60.63)
CSK: length 110.5
  Top Layer w0.254: v1(21.46,62.79) 3.81,62.79 2.9,63.7 2.9,68.1 v1(5.84,71.04)
  Bottom Layer w0.254: H1.10 23.5,62.79 v1(21.46,62.79) ; v1(5.84,71.04) 5.84,75.11 1.9,79.05 1.9,91.36 8,97.46 50.29,97.46 51.94,95.81
CSN: length 62.5
  Top Layer w0.254: v1(43.05,61.9) 42.67,61.9 H1.14 ; v1(55.75,75.87) 53.97,74.09 v1(53.97,71.68) ; v1(51.69,87.17) 52.83,88.32 v1(56.52,88.32) ; v1(56.77,68.89) 58.17,68.89 v1(58.67,68.38) ; v1(56.52,90.48) 55.12,90.48 54.48,91.11 H5.4 ; v1(57.02,65.84) v1(55.63,64.44)
  Bottom Layer w0.254: v1(58.67,68.38) 58.67,67.49 v1(57.02,65.84) ; v1(55.75,75.87) 55.75,82.09 51.69,86.16 v1(51.69,87.17) ; v1(55.63,64.44) 53.09,61.9 v1(43.05,61.9) ; v1(56.52,90.48) 57.02,89.97 57.02,88.82 v1(56.52,88.32) ; v1(56.77,68.89) v1(53.97,71.68)
IRQ: length 74.6
  Top Layer w0.254: v1(50.42,89.71) 50.42,92.25 49.4,93.27 ; v1(67.82,59.23) v1(67.82,68.12) ; v1(65.15,56.57) 50.54,56.57 H1.15
  Bottom Layer w0.254: v1(67.82,68.12) 67.82,72.31 v1(50.42,89.71) ; v1(65.15,56.57) v1(67.82,59.23)
KEY1: length 126.4
  Top Layer w0.254: H2.10 27.56,75.49 v1(29.46,73.58) ; R8.1 51.99,31.52 C14.1 48.77,34.74 48.77,37.14 50.04,38.41 60.07,38.41 ; 60.07,38.41 v1(61.34,37.14) ; 60.07,38.41 90.04,38.41 SW8.1
  Bottom Layer w0.254: v1(29.46,73.58) 30.86,72.19 49.66,72.19 61.34,60.5 v1(61.34,37.14)
KEY2: length 135.2
  Top Layer w0.254: 71.32,38.76 82.93,38.76 84.2,40.03 SW9.1 ; 71.32,38.76 71.32,52.56 56.27,67.62 55.63,67.62 54.36,68.89 v1(42.8,68.89) ; 71.32,38.76 49.89,38.76 49.66,38.53 49.66,38.53 48.41,37.29 48.41,30.12 49.53,29.01 54.59,29.01 R9.1 55.29,32.75 C15.1 ; v1(25.02,72.19) v1(25.02,74.98)
  Bottom Layer w0.254: v1(42.8,68.89) 39.85,71.83 25.37,71.83 v1(25.02,72.19) ; v1(25.02,74.98) H2.9
KEY3: length 105.4
  Top Layer w0.254: v1(56.13,68.25) 75.31,49.07 75.31,43.36 v1(73.28,41.33) SW10.1 ; H2.8 22.48,78.54 28.07,72.95 v1(51.43,72.95) ; 58.59,32.9 R10.1 ; 58.59,32.9 C16.1 ; 58.59,32.9 57.87,32.9 57.02,32.06
  Bottom Layer w0.254: v1(57.02,31.87) 63.82,31.87 v1(73.28,41.33) ; v1(56.13,68.25) v1(51.43,72.95)
KEY4: length 105.4
  Top Layer w0.254: C17.1 61.9,31.66 ; 61.9,31.66 R11.1 ; 61.9,31.66 61.15,30.91 60.96,30.91 ; v1(81.03,50.98) 84.17,50.98 SW11.1
  Bottom Layer w0.254: 79.37,49.14 79.37,49.33 v1(81.03,50.98) ; 79.37,49.14 79.37,43.87 66.29,30.78 v1(60.83,30.78) ; 79.37,49.14 53.91,74.6 34.42,74.6 30.1,78.92 H2.11
KEY5: length 129.1
  Top Layer w0.254: v1(57.78,67.87) 77.32,48.34 v1(87.53,48.34) ; 66.47,31.69 65.2,30.42 R12.1 ; 66.47,31.69 67.12,31.04 v1(68.33,31.04) ; 66.47,31.69 C18.1 ; v1(90.17,50.98) 92.94,50.98 SW12.1
  Bottom Layer w0.254: v1(90.17,50.98) v1(87.53,48.34) 70.23,31.04 v1(68.33,31.04) ; v1(57.78,67.87) 57.78,69.39 52.93,74.24 20.04,74.24 14.86,79.43 H2.5
LED0: length 5.4
  Top Layer w0.254: LED4.2 47.87,82.09 H2.18
LED1: length 5.4
  Top Layer w0.254: LED5.2 45.33,82.09 H2.17
MISO: length 104.9
  Top Layer w0.254: v1(6.35,86.92) 2.54,83.11 2.54,73.71 v1(3.68,72.57) ; v1(21.46,61.01) 3.94,61.01 v1(3.56,61.39)
  Bottom Layer w0.254: v1(6.35,86.92) 13.08,93.65 43.56,93.65 45.72,95.81 49.4,95.81 ; v1(21.46,61.01) 24.26,61.01 H1.11 ; v1(3.56,61.39) 1.88,63.07 1.88,70.77 v1(3.68,72.57)
MOSI: length 71.8
  Top Layer w0.254: H1.12 40.25,59.23 v1(45.97,59.23) ; v1(57.53,62.66) 58.55,63.68 v1(58.55,64.31) ; v1(59.31,67.62) 60.45,68.76 v1(61.85,68.76) ; 51.94,93.27 52.83,92.38 v1(52.83,89.71) ; v1(64.64,74.09) 64.64,74.85 v1(65.66,75.87)
  Bottom Layer w0.254: v1(57.53,62.66) 54.1,59.23 v1(45.97,59.23) ; v1(61.85,68.76) 63.75,68.76 64.64,69.65 v1(64.64,74.09) ; v1(58.55,64.31) 58.55,66.85 v1(59.31,67.62) ; v1(52.83,89.71) 54.1,89.71 65.66,78.16 v1(65.66,75.87)
PA1: length 40.9
  Top Layer w0.254: SW1.5 14.73,49.58 v1(14.73,49.58)
  Bottom Layer w0.254: v1(14.73,49.58) 17.4,52.25 H1.6
PA2: length 52.4
  Top Layer w0.254: v1(20.95,28.75) 22.22,28.75 25.53,25.45 25.53,20.43 SW1.2
  Bottom Layer w0.254: v1(20.95,28.75) 19.94,29.77 H1.7
PA3: length 129.3
  Top Layer w0.254: SW7.2 98.68,24.83 98.68,65.83 94.64,69.88 25.51,69.88 H1.8
PA4: length 125.2
  Top Layer w0.254: SW7.5 86.92,30.53 94.49,30.53 98.3,34.34 98.3,65.71 94.49,69.52 27.69,69.52 H1.9
PB12: length 127.9
  Top Layer w0.254: v1(61.21,65.33) v1(61.21,68.12) ; v1(59.69,60.88) v1(59.69,63.04) ; v1(20.7,33.33) v1(16.38,33.33)
  Bottom Layer w0.254: v1(59.69,63.04) 59.69,63.81 v1(61.21,65.33) ; H2.20 52.96,76.38 v1(61.21,68.12) ; v1(20.7,33.33) 30.23,33.33 36.83,39.93 55.12,39.93 60.98,45.8 60.98,59.59 v1(59.69,60.88) ; SW1.d 13.33,12.94 13.33,24.44 12.19,25.58 10.03,25.58 8.76,26.85 8.76,32.06 10.16,33.45 16.26,33.45
PB13: length 123.6
  Top Layer w0.254: SW7.d 99.06,20.17 99.06,72.31 94.49,76.89 52.83,76.89 50.42,79.3 H2.19
SCL: length 62.2
  Top Layer w0.254: OLED1.3 75.06,86.16 v1(51.05,86.16)
  Bottom Layer w0.254: H2.7 24.01,86.16 v1(51.05,86.16)
SDA: length 67.3
  Top Layer w0.254: v1(24.51,85.01) 20.33,85.01 H2.6 ; v1(51.05,85.01) 76.45,85.01 OLED1.4
  Bottom Layer w0.254: v1(51.05,85.01) v1(24.51,85.01)
VUSB: length 46.6
  Top Layer w0.254: 38.35,6.78 33.53,6.78 32.89,7.42 U1.8 ; 38.35,6.78 40.12,8.54 C19.2 48.29,9.83 49.43,8.69 ; 38.35,6.78 37.97,6.4 37.97,3.1 37.1,2.22 U1.4 ; 49.43,8.69 62.1,8.69 62.96,7.83 USB1.1 ; 49.43,8.69 48.77,8.69 47.74,7.66 U12.2 U13.2
$1N9186: length 13.2
  Top Layer w0.254: U1.2 34.16,1.5 34.72,0.94 45.73,0.94 U10.1
$1N9797: length 13.9
  Top Layer w0.254: v1(34.16,9.83) U1.7 ; LED1.1 v1(40,6.37)
  Bottom Layer w0.254: v1(40,6.37) 38.99,7.38 38.99,10.85 38.23,11.61 35.05,11.61 34.16,10.72 34.16,9.96
$1N9800: length 14.3
  Top Layer w0.254: 40.95,3.95 v1(40,3.95) ; v1(35.43,9.83) U1.6
  Bottom Layer w0.254: v1(40,3.95) 38.99,4.97 38.99,6.88 38.63,7.23 38.63,10.7 38.08,11.25 36.2,11.25 35.43,10.49 35.43,9.96
$1N9803: length 3.7
  Top Layer w0.254: U12.1 42.56,6.36 LED1.2
$1N9806: length 3.7
  Top Layer w0.254: U13.1 42.6,3.9 LED2.2
$1N10862: length 3.2
  Top Layer w0.254: LED3.2 29.22,47.8 U14.1
$1N14342: length 4.5
  Top Layer w0.254: U16.1 33.53,46.67 33.53,49.64 U4.4
$1N14522: length 12
  Top Layer w0.254: U4.3 33.59,51.34 34.08,50.85 38.99,50.85 39.62,51.48 R7.2 39.62,53.27 38.11,54.78 R13.1
$1N32004: length 31.7
  Top Layer w0.254: U4.1 35.49,57.76 v1(34.74,58.51) D3.2 ; v1(43.43,46.66) 44.58,45.52 U6.1
  Bottom Layer w0.254: v1(34.74,58.51) 38.57,58.51 43.43,53.65 v1(43.43,46.66)

Small or netless copper shapes (teardrops, artwork), in the pictures only: 313 on Top Layer, 113 on Bottom Layer

## Text on the board
Top Layer: By FlandreDT | 南梁·北朝
